# EAGLE schematic RN42 (EAGLE 9.5.0)
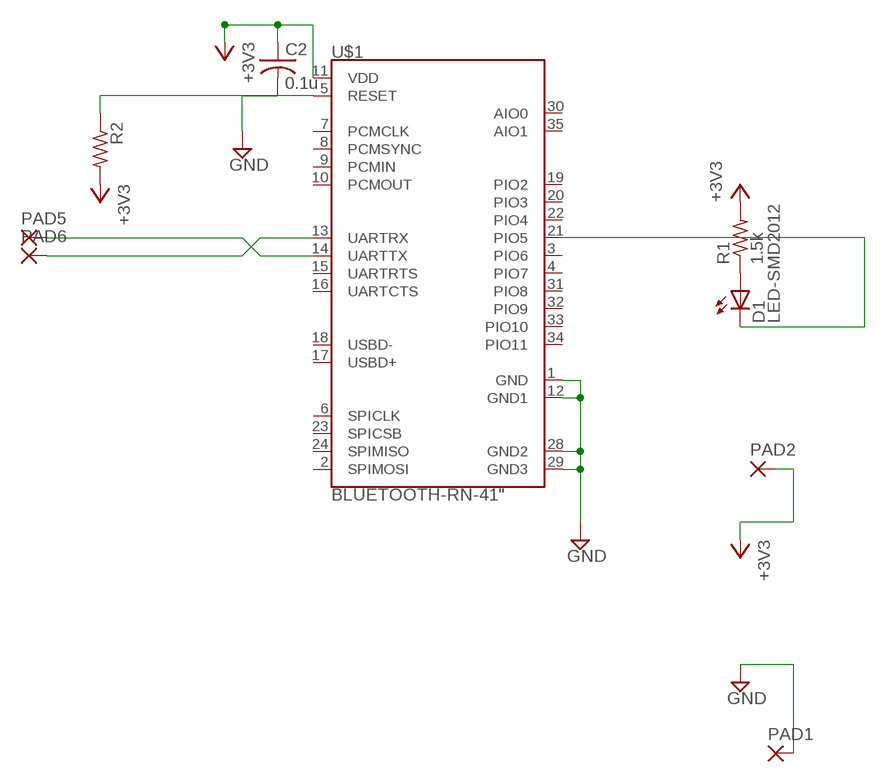
[diagram p0: schematic, sheet 1]

## Parts
C2  0.1u  C-2012  [2012-C]
D1  LED-SMD2012  [D2012]
PAD1  SMD5  [SMD2,54-5,08]
PAD2  SMD5  [SMD2,54-5,08]
PAD5  SMD5  [SMD2,54-5,08]
PAD6  SMD5  [SMD2,54-5,08]
R1  1.5k  R-2012  [2012-R]
R2  10k  R-2012  [2012-R]
U$1  BLUETOOTH-RN-41"  [RN41]

## Nets
+3V3: C2.1 PAD2.1(P) R1.2 R2.2 U$1.11(VDD)
GND: C2.2 PAD1.1(P) U$1.1(GND) U$1.12(GND1) U$1.28(GND2) U$1.29(GND3)
N$1: D1.K U$1.21(PIO5)
N$2: D1.A R1.1
N$3: PAD5.1(P) U$1.14(UARTTX)
N$4: R2.1 U$1.5(RESET)
N$6: PAD6.1(P) U$1.13(UARTRX)
Unconnected: U$1.2(SPIMOSI) U$1.3(PIO6) U$1.4(PIO7) U$1.6(SPICLK) U$1.7(PCMCLK) U$1.8(PCMSYNC) U$1.9(PCMIN) U$1.10(PCMOUT) U$1.15(UARTRTS) U$1.16(UARTCTS) U$1.17(USBD+) U$1.18(USBD-) U$1.19(PIO2) U$1.20(PIO3) U$1.22(PIO4) U$1.23(SPICSB) U$1.24(SPIMISO) U$1.30(AIO0) U$1.31(PIO8) U$1.32(PIO9) U$1.33(PIO10) U$1.34(PIO11) U$1.35(AIO1)

## Library data of the parts
C2 = Passive_Robotech:C
D1 = Diode_Robotech:LED
PAD1 PAD2 PAD5 PAD6 = wirepad:SMD5: SMD PAD
R1 R2 = Passive_Robotech:R
U$1 = SparkFun-RF:BLUETOOTH-RN-41: Roving Networks RN-41 Bluetooth Module The RN-41 module is a small form factor, low power, class 1 Bluetooth radio that is ideal for designers who want to add wireless capability to their products without spending significant time and money developing Bluetooth-specific hardware and software. The RN-41 supports multiple interface protocols, is simple to design in, and is fully certified, making it a complete embedded Bluetooth solution. SparkFun Products: Bluetooth SMD Module - RN-41 <https://www.sparkfun.com/products/12575> (WRL-12575) Bluetooth Module Breakout - Roving Networks (RN-41 v6.15) <https://www.sparkfun.com/products/12579> (WRL-12579); PROD_ID: IC-11844; SF_ID: WRL-12575